# Altium schematic sheet DIOT_P1.SchDoc: DIOT connector
size A3; Author: M.Beldyga; CompanyName: WUT ISE; DrawnBy: M.Beldyga; Organization: WUT ISE; Address1: PW ISE; Address2: Nowowiejska 15/19 00-665 Warsaw; Address3: micbeldyga@gmail.com; SheetNumber: 6; SheetTotal: 8; ModifiedBy: -; CheckedDate: -; DivGrp: WUT ISE; Designer: M.Beldyga; ModifiedDate: -; ProjectName: Sensor Box
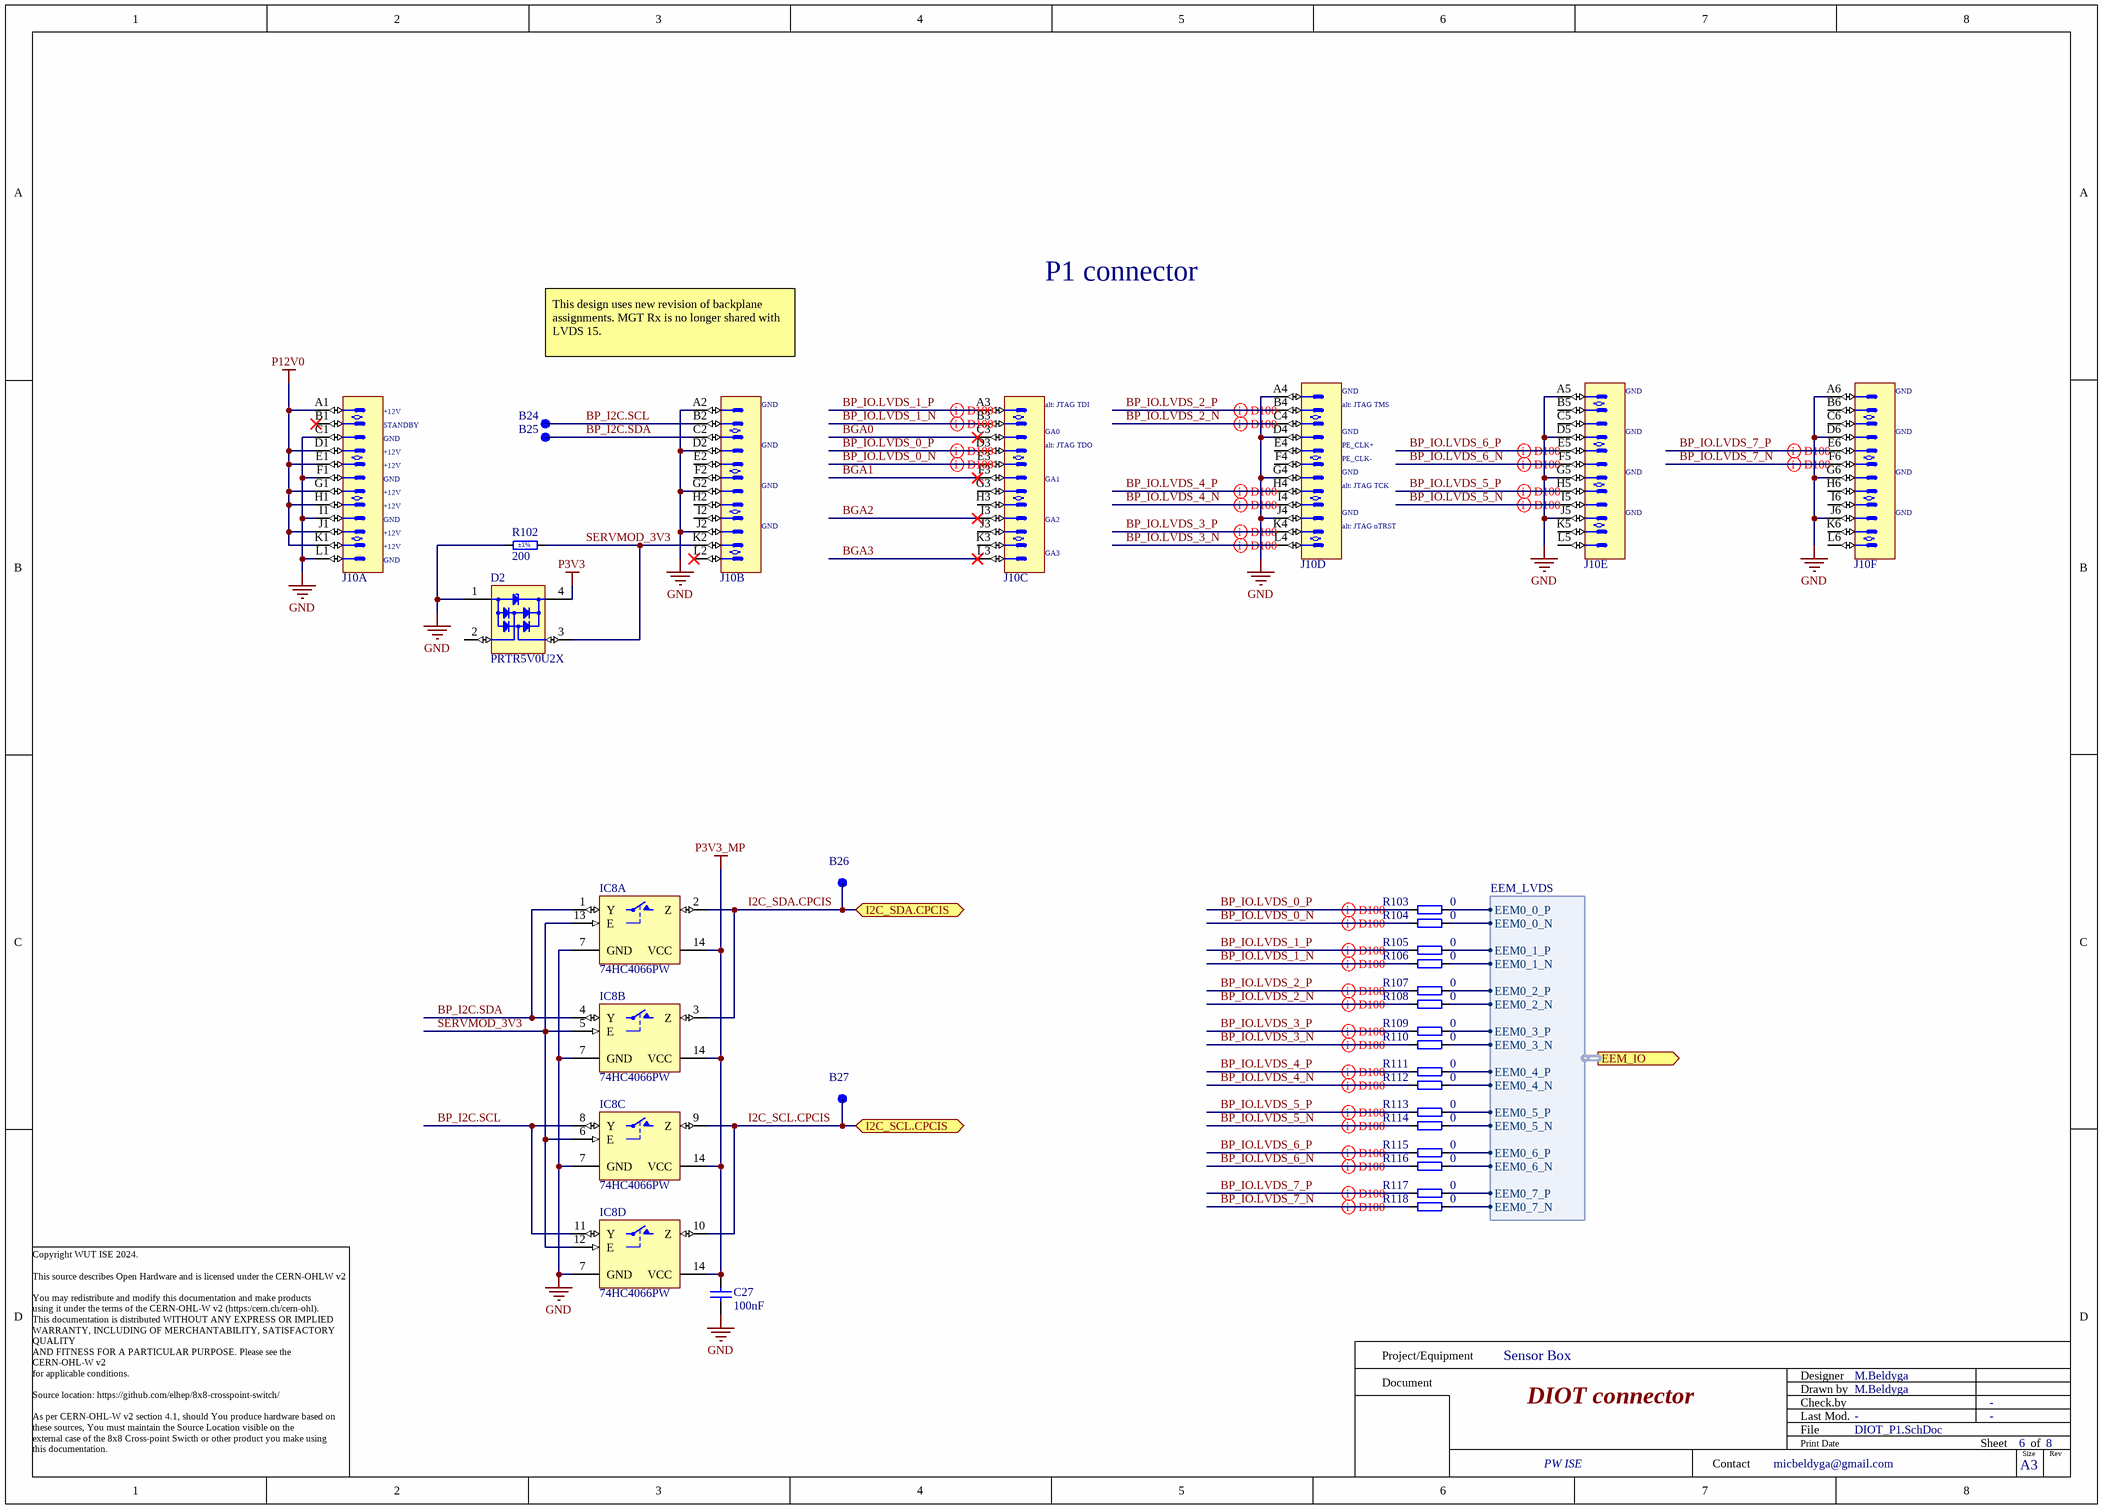
[diagram p0: DIOT_P1.SchDoc]

## Parts
B24  SMD Pad  [C100]  (value not drawn)  (no BOM)
B25  SMD Pad  [C100]  (value not drawn)  (no BOM)
B26  SMD Pad  [C100]  (value not drawn)  (no BOM)
B27  SMD Pad  [C100]  (value not drawn)  (no BOM)
C27  100nF  [CAPC1005X55N]
D2  PRTR5V0U2X  [SOT190P230X110-4N]
IC8  74HC4066PW  [SOP65P640X110-14N]  (parts A,B,C,D of 4)
J10  AirMax VS  [AMPHENOL_10052825-101LF]  (value not drawn)  (parts A,B,C,D,E,F of 6)
R102  200  Tolerance: ±1%  [RESC1608X55N]
R103  0  [RESC1005X40N]
R104  0  [RESC1005X40N]
R105  0  [RESC1005X40N]
R106  0  [RESC1005X40N]
R107  0  [RESC1005X40N]
R108  0  [RESC1005X40N]
R109  0  [RESC1005X40N]
R110  0  [RESC1005X40N]
R111  0  [RESC1005X40N]
R112  0  [RESC1005X40N]
R113  0  [RESC1005X40N]
R114  0  [RESC1005X40N]
R115  0  [RESC1005X40N]
R116  0  [RESC1005X40N]
R117  0  [RESC1005X40N]
R118  0  [RESC1005X40N]

## Ports
EEM_IO (out, harness EEM_LVDS), I2C_SCL.CPCIS (bidir), I2C_SDA.CPCIS (bidir)

## Harnesses
EEM_LVDS: EEM0_0_P, EEM0_0_N, EEM0_1_P, EEM0_1_N, EEM0_2_P, EEM0_2_N, EEM0_3_P, EEM0_3_N, EEM0_4_P, EEM0_4_N, EEM0_5_P, EEM0_5_N, EEM0_6_P, EEM0_6_N, EEM0_7_P, EEM0_7_N

## Nets
GND: C27.1 D2.1(GND) IC8.7(GND) J10.A2 J10.A4 J10.A5 J10.A6 J10.C1 J10.D2 J10.D4 J10.D5 J10.D6 J10.F1 J10.G2 J10.G4 J10.G5 J10.G6 J10.I1 J10.J2 J10.J4 J10.J5 J10.J6 J10.L1 R102.1
P3V3: D2.4(VCC)
P3V3_MP: C27.2 IC8.14(VCC)
P12V0: J10.A1 J10.D1 J10.E1 J10.G1 J10.H1 J10.J1 J10.K1
BGA0: J10.C3
BGA1: J10.F3
BGA2: J10.I3
BGA3: J10.L3
BP_I2C.SCL: B24.1 IC8.8(Y) IC8.11(Y) J10.B2
BP_I2C.SDA: B25.1 IC8.1(Y) IC8.4(Y) J10.C2
BP_IO.LVDS_0_N: J10.E3 R104.1
BP_IO.LVDS_0_P: J10.D3 R103.1
BP_IO.LVDS_1_N: J10.B3 R106.1
BP_IO.LVDS_1_P: J10.A3 R105.1
BP_IO.LVDS_2_N: J10.C4 R108.1
BP_IO.LVDS_2_P: J10.B4 R107.1
BP_IO.LVDS_3_N: J10.L4 R110.1
BP_IO.LVDS_3_P: J10.K4 R109.1
BP_IO.LVDS_4_N: J10.I4 R112.1
BP_IO.LVDS_4_P: J10.H4 R111.1
BP_IO.LVDS_5_N: J10.I5 R114.1
BP_IO.LVDS_5_P: J10.H5 R113.1
BP_IO.LVDS_6_N: J10.F5 R116.1
BP_IO.LVDS_6_P: J10.E5 R115.1
BP_IO.LVDS_7_N: J10.F6 R118.1
BP_IO.LVDS_7_P: J10.E6 R117.1
I2C_SCL.CPCIS: B27.1 IC8.9(Z) IC8.10(Z) ; port I2C_SCL.CPCIS
I2C_SDA.CPCIS: B26.1 IC8.2(Z) IC8.3(Z) ; port I2C_SDA.CPCIS
SERVMOD_3V3: D2.3(I/O2) IC8.5(E) IC8.6(E) IC8.12(E) IC8.13(E) J10.K2 R102.2
NetR103_2: R103.2 ; port EEM_IO.EEM0_0_P
NetR104_2: R104.2 ; port EEM_IO.EEM0_0_N
NetR105_2: R105.2 ; port EEM_IO.EEM0_1_P
NetR106_2: R106.2 ; port EEM_IO.EEM0_1_N
NetR107_2: R107.2 ; port EEM_IO.EEM0_2_P
NetR108_2: R108.2 ; port EEM_IO.EEM0_2_N
NetR109_2: R109.2 ; port EEM_IO.EEM0_3_P
NetR110_2: R110.2 ; port EEM_IO.EEM0_3_N
NetR111_2: R111.2 ; port EEM_IO.EEM0_4_P
NetR112_2: R112.2 ; port EEM_IO.EEM0_4_N
NetR113_2: R113.2 ; port EEM_IO.EEM0_5_P
NetR114_2: R114.2 ; port EEM_IO.EEM0_5_N
NetR115_2: R115.2 ; port EEM_IO.EEM0_6_P
NetR116_2: R116.2 ; port EEM_IO.EEM0_6_N
NetR117_2: R117.2 ; port EEM_IO.EEM0_7_P
NetR118_2: R118.2 ; port EEM_IO.EEM0_7_N

Not connected (* = marked no-connect by the designer): D2 2(I/O1); J10 B1* B5 B6 C5 C6 E2 E4 F2 F4 G3 H2 H3 H6 I2 I6 J3 K3 K5 K6 L2* L5 L6

## Layout directives
differential pair; net class D100: BP_IO.LVDS_0_N, BP_IO.LVDS_0_P, BP_IO.LVDS_1_N, BP_IO.LVDS_1_P, BP_IO.LVDS_2_N, BP_IO.LVDS_2_P, BP_IO.LVDS_3_N, BP_IO.LVDS_3_P, BP_IO.LVDS_4_N, BP_IO.LVDS_4_P, BP_IO.LVDS_5_N, BP_IO.LVDS_5_P, BP_IO.LVDS_6_N, BP_IO.LVDS_6_P, BP_IO.LVDS_7_N, BP_IO.LVDS_7_P

## Notes on the sheet
- P1 connector
- This design uses new revision of backplane assignments. MGT Rx is no longer shared with LVDS 15.
- (near J10) +12V
- (near J10) STANDBY
- (near J10) GND
- (near J10) alt: JTAG TDI
- (near J10) alt: JTAG TDO
- (near J10) GA0
- (near J10) alt: JTAG TMS
- (near J10) PE_CLK+
- (near J10) GA1
- (near J10) alt: JTAG TCK
- (near J10) PE_CLK-
- (near J10) GA2
- (near J10) GA3
- (near J10) alt: JTAG nTRST
- Copyright WUT ISE 2024.
  This source describes Open Hardware and is licensed under the CERN-OHLW v2
  You may redistribute and modify this documentation and make products
  using it under the terms of the CERN-OHL-W v2 (https:/cern.ch/cern-ohl).
  This documentation is distributed WITHOUT ANY EXPRESS OR IMPLIED
  WARRANTY, INCLUDING OF MERCHANTABILITY, SATISFACTORY QUALITY
  AND FITNESS FOR A PARTICULAR PURPOSE. Please see the CERN-OHL-W v2
  for applicable conditions.
  Source location: https://github.com/elhep/8x8-crosspoint-switch/
  As per CERN-OHL-W v2 section 4.1, should You produce hardware based on
  these sources, You must maintain the Source Location visible on the
  external case of the 8x8 Cross-point Swicth or other product you make using
  this documentation.
- Project/Equipment
- Document
- Designer
- Drawn by
- Check.by
- Contact
- File
- Last Mod.
- Print Date
- Sheet
- Size
- A3
- of
- Rev

## Library data of the parts
B24-B27 = SMD_PAD_D1MM: Pad; Part Description: 1mm Diameter SMD Pad; Mounted: No; Part Number: SMD_PAD_D1MM; Component Type: Standard (No BOM); Pin Count: 1; Family: SMD Pad; Socket: No; SMD: Yes; Sense: No; Status: None; ComponentHeight: 0mm; HelpURL: Undefined; Author: CERN DEM JLC; CreateDate: 10/10/2017; LatestRevisionDate: 10/10/2017; PackageDescription: 1mm Diameter SMD Pad
C27 = CC0402_100NF_50V_10%_X7R: Non-polarised capacitor; Part Description: SMD Multilayer Chip Ceramic Capacitor; Manufacturer: GENERIC; Manufacturer1 Part Number: GRM155R71H104KE14D; Voltage: 50V; TC: X7R; Tolerance: ±10%; Part Number: CC0402_100NF_50V_10%_X7R; Component Kind: Standard; Component Type: Standard; Pin Count: 2; Value: 100nF; Status: None; Manufacturer Part Number: CC0402_100NF_50V_10%_X7R; Case: 0402; Mounted: Yes; Socket: No; SMD: Yes; Sense: No; Manufacturer1 Example: MURATA; Manufacturer1 ComponentHeight: 0.55mm; HelpURL: \\cern.ch\dfs\Applications\Altium\Datasheets\CC0402_MURATA_GRM155R71H104KE14D.pdf; Author: CERN DEM MR; CreateDate: 6/30/2017; LatestRevisionDate: 6/30/2017
D2 = PRTR5V0U2X: Ultra Low Capacitance Double Rail-to-Rail ESD Protection Diode; Part Description: Ultra Low Capacitance (1pF) Double Rail-to-Rail ESD Protection Diode (8kV); Manufacturer: NXP SEMICONDUCTORS; Voltage: 5.5V; PressFit: No; Bonding: No; Part Number: PRTR5V0U2X; Component Kind: Standard; Component Type: Standard; Device: PRTR5V0U2X; PackageDescription: SOT143B, SOT, 1.90mm Pitch; 4 Pin, 1.30mm W X 2.90mm L X 1.10mm H body, IPC Medium Density; Manufacturer Part Number: PRTR5V0U2X; Pin Count: 4; Case: SOT143B; Mounted: Yes; Socket: No; SMD: Yes; Sense: No; ComponentHeight: 1.1mm; HelpURL: \\cern.ch\dfs\Applications\Altium\Datasheets\PRTR5V0U2X.pdf; Author: CERN DEM JLC; CreateDate: 3/22/2011; LatestRevisionDate: 3/22/2011
IC8 = 74HC4066PW: Quad Single-Pole Single-Throw Analog Switch; Manufacturer: NXP SEMICONDUCTORS; PressFit: No; Bonding: No; Part Number: 74HC4066PW; Component Kind: Standard; Component Type: Standard; Device: 74HC4066PW; PackageDescription: SOP, 0.65mm Pitch; 14 Pin, 4.40mm W X 5.00mm L X 1.20mm H body, IPC Medium Density; Part Description: Quad Single-Pole Single-Throw Analog Switch; Manufacturer Part Number: 74HC4066PW; Pin Count: 14; Case: TSSOP14; Mounted: Yes; Socket: No; SMD: Yes; Sense: No; ComponentHeight: 1.1mm; Author: CERN DEM JLC; HelpURL: \\cern.ch\dfs\Applications\Altium\Datasheets\74HC4066PW.pdf; CreateDate: 11/19/2014; LatestRevisionDate: 11/19/2014
J10 = AMPHENOL_10052825-101LF: 72 Contacts Header, 6 Columns, 4 Pairs per Column; Part Description: 72 Contacts, 2mm Pitch, 6 Columns, 4 Pairs per Column, 4 Walls, Right Angle Header; Part Number: AMPHENOL_10052825-101LF; Component Kind: Standard; Component Type: Standard; Pin Count: 72; Family: AirMax VS; Mounted: Yes; Socket: No; SMD: No; PressFit: Yes; Sense: No; Status: None; Manufacturer: AMPHENOL; Manufacturer Part Number: 10052825-101LF; ComponentHeight: 15.35mm; HelpURL: \\cern.ch\dfs\Applications\Altium\Datasheets\AMPHENOL_10052825-101LF.pdf; ComponentLink1URL: \\cern.ch\dfs\Applications\Altium\Datasheets\AMPHENOL_10052825-101LF_Application.pdf; ComponentLink1Description: Application; Author: CERN DEM MR; CreateDate: 2/19/2018; LatestRevisionDate: 2/19/2018
R102 = R0603_200R_1%_0.1W_100PPM: Resistor - 1%; Part Description: General Purpose Thick Film Chip Resistor; Manufacturer: GENERIC; Manufacturer1 Part Number: NRC06F2000TRF; Power: 0.1W; TC: ±100ppm/°C; PressFit: No; Part Number: R0603_200R_1%_0.1W_100PPM; Component Kind: Standard; Component Type: Standard; Pin Count: 2; Value: 200; Status: Preferred; Manufacturer Part Number: R0603_200R_1%_0.1W_100PPM; Case: 0603; Mounted: Yes; Sense: No; Socket: No; SMD: Yes; Manufacturer1 Example: NIC COMPONENT; Manufacturer1 ComponentHeight: 0.55mm; HelpURL: \\cern.ch\dfs\Applications\Altium\Datasheets\R0603_NIC_NRC.pdf; Author: CERN DEM JLC; CreateDate: 12/3/2007; LatestRevisionDate: 3/13/2008
R103-R118 = R0402_0R_JUMPER: Resistor; Part Description: 1A (0.05R Max DC Resistance) Zero Ohm Jumper; Manufacturer: GENERIC; Manufacturer1 Part Number: 232270591001L; PressFit: No; Part Number: R0402_0R_JUMPER; Component Kind: Standard; Component Type: Standard; Pin Count: 2; Value: 0; Status: Not Recommended; Manufacturer Part Number: R0402_0R_JUMPER; Case: 0402; Mounted: Yes; Sense: No; Socket: No; SMD: Yes; Manufacturer1 Example: YAGEO PHYCOMP; Manufacturer1 ComponentHeight: 0.4mm; HelpURL: \\cern.ch\dfs\Applications\Altium\Datasheets\R0402_Phycomp_RC0402.pdf; Author: CERN DEM JLC; CreateDate: 12/3/2007; LatestRevisionDate: 10/17/2012